# EasyEDA schematic schema_eletrico_PED.json
TITLE: Schema elettrico; REV: 1.0; Date: 2019-05-30; Sheet: 1/1; Drawn By: Berselli, Di Blasi; Company: unimore
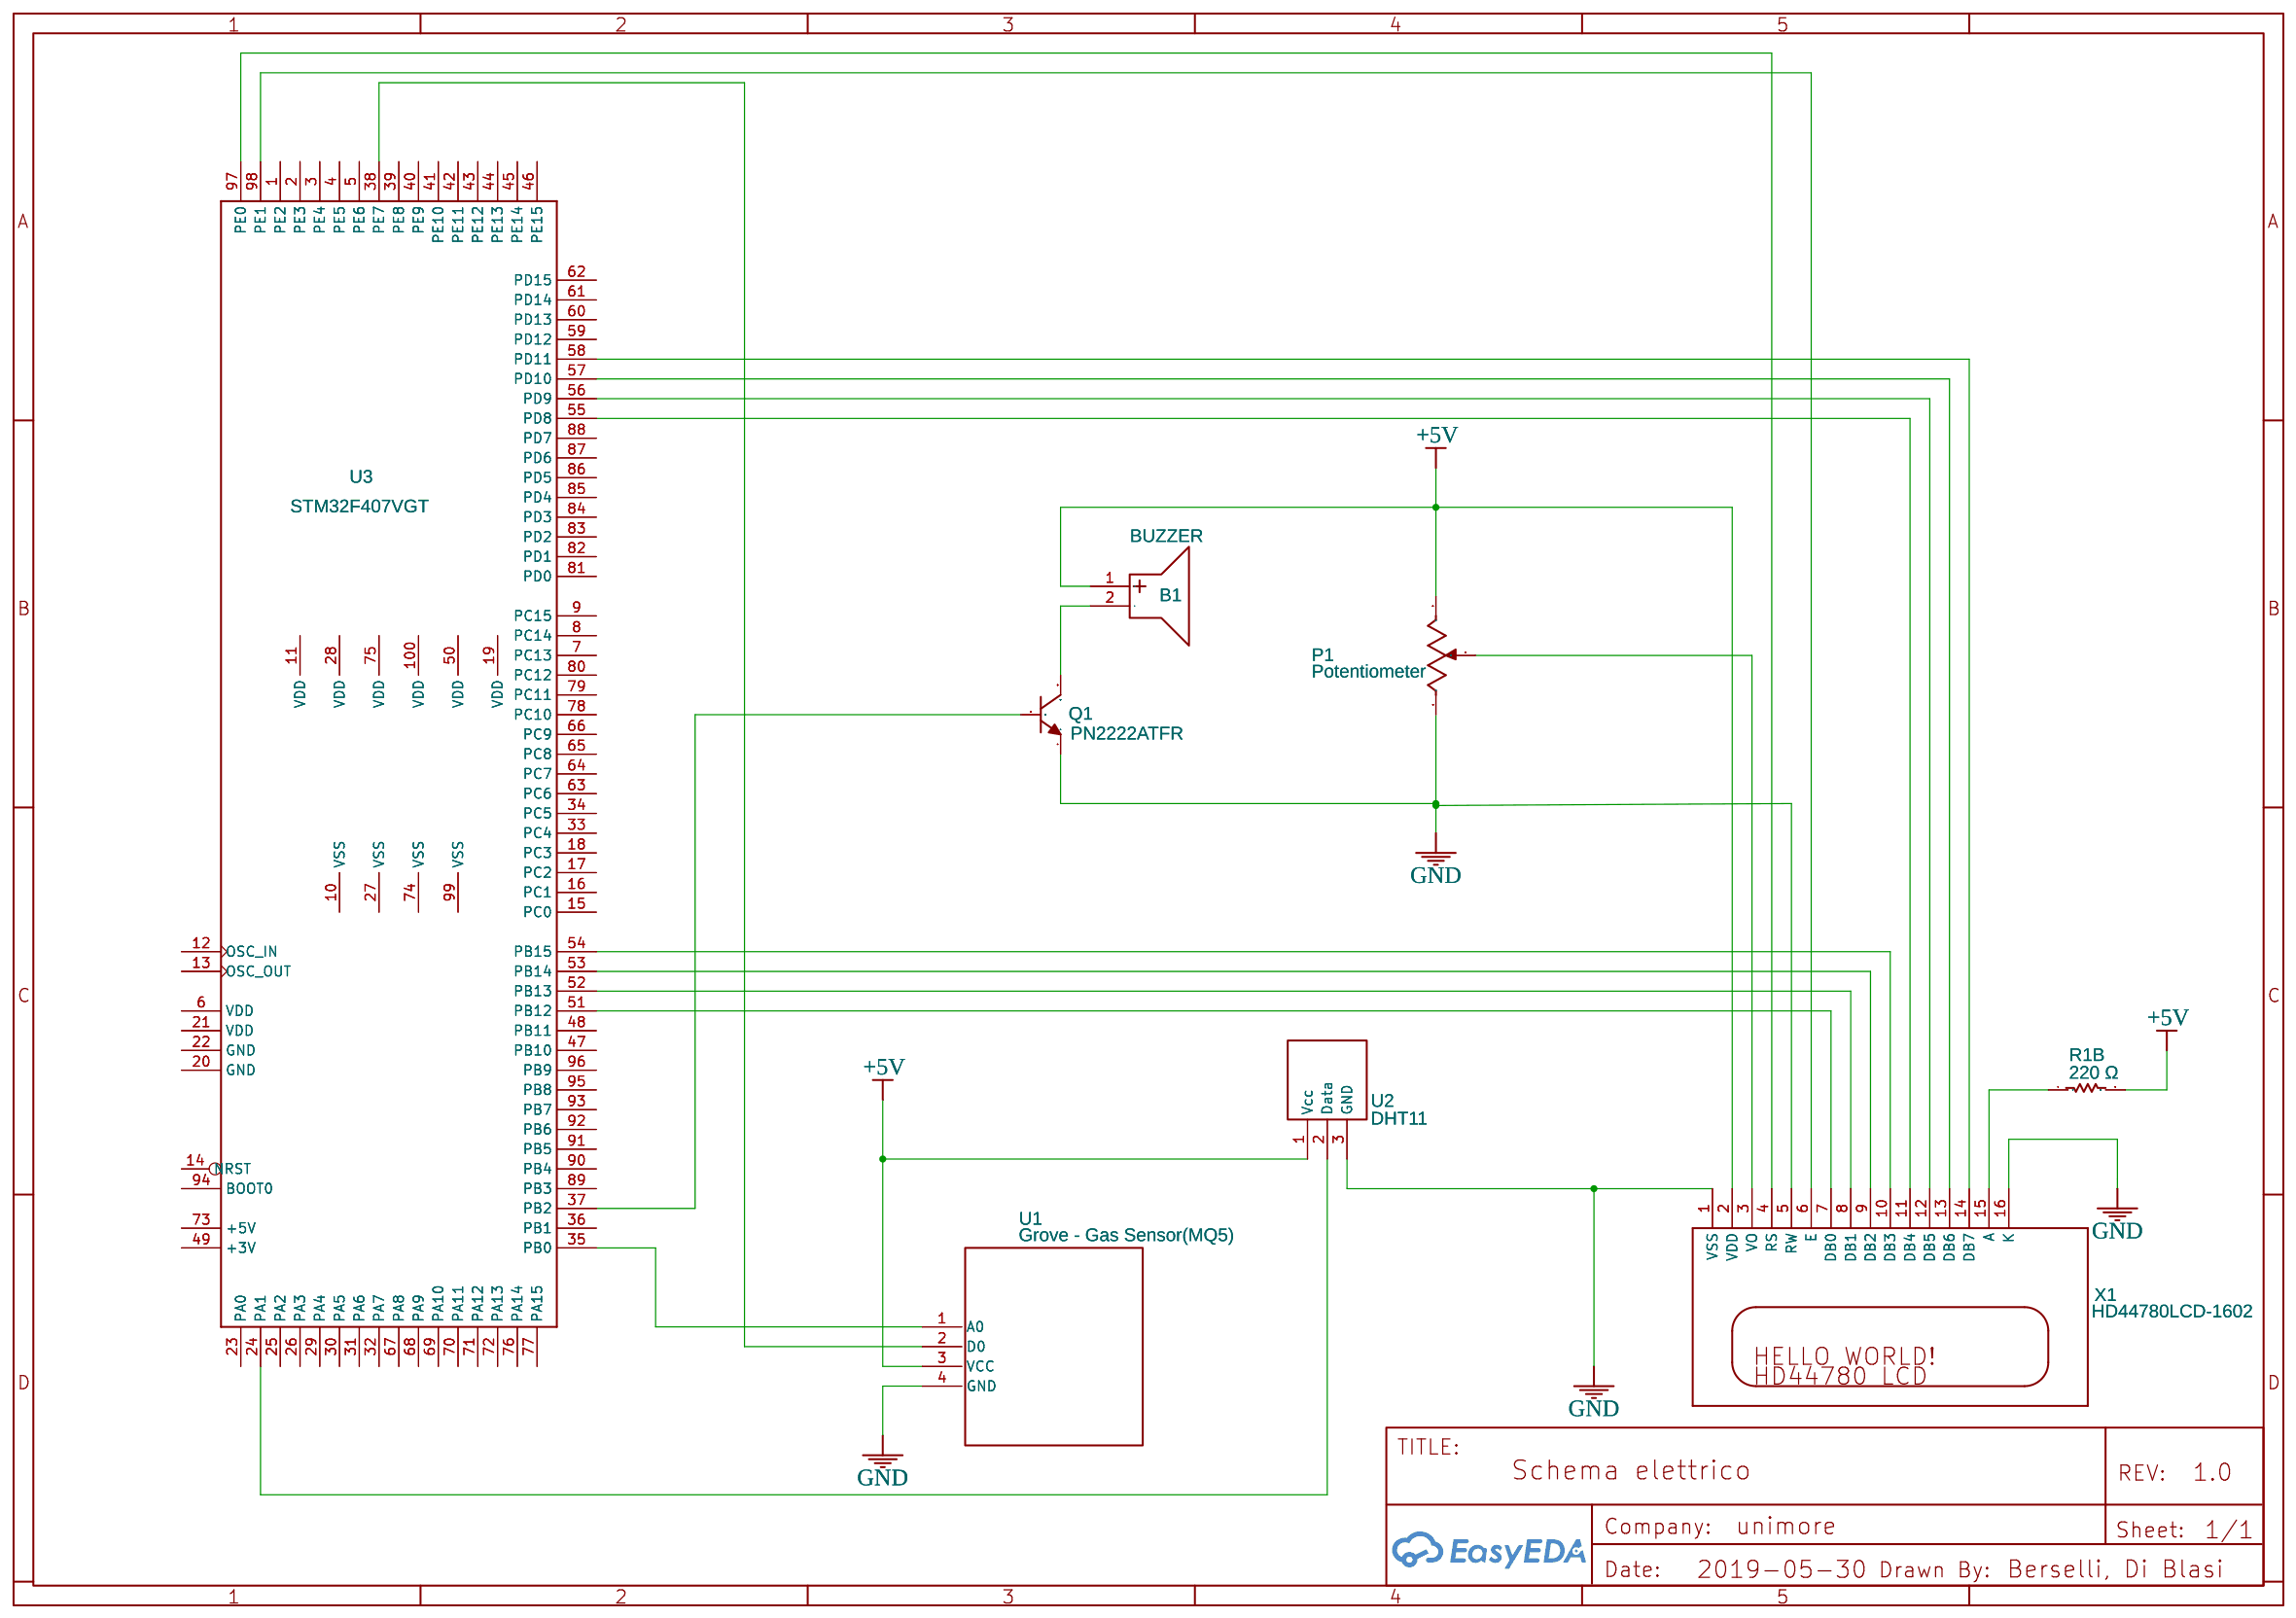
[diagram p0: schematic sheet]

## Parts
B1  BUZZER  [BUZZER-R6.0-2P-6.5PITCH]
P1  Potentiometer  [TRIM_POT]
Q1  PN2222ATFR  [TO-92(TO-92-3)-2.54]
R1B  220 Ω  [R0603]
U1  Grove - Gas Sensor(MQ5)  [GROVE - GAS SENSOR(MQ5)]
U2  DHT11
U3  STM32F407VGT  [LQFP100]
X1  HD44780LCD-1602  [LCD1602]

## Library data of the parts
B1 = -: Supplier: LCSC; Supplier Part: C187885; Manufacturer: Dongguan Bolin Elec; Manufacturer Part: BL-PBZ1209C2003YB-H; Contributor: LCSC
P1 = -: Contributor: breezebro; Manufacturer Part: ?
Q1 = -: Supplier: LCSC; Supplier Part: C184875; Manufacturer: ON Semicon; Contributor: LCSC
R1B = -: Supplier Part: P100KHCT-ND; Supplier: Digi-Key; Contributor: Mikhail Gofman; Manufacturer Part: ?
U1 = -: sourceId: yfdbxveAk; Supplier Part: undefined; Supplier: SeeedStudio; Manufacturer Part: ?
U2 = -: Contributor: Sases
U3 = -: Manufacturer Part: ?
X1 = -: HD44780 LCD; Contributor: Adafruit; Manufacturer Part: ?

## Nets
+5V: B1.1(+) P1.2(E) R1B.2 U1.3(VCC) U2.1(Vcc) X1.2(VDD)
GND: P1.3(A) Q1.1(E) U1.4(GND) U2.3(GND) X1.1(VSS) X1.5(RW) X1.16(K)
Net-(B1-2): B1.2(-) Q1.3(C)
Net-(P1-1): P1.1(S) X1.3(VO)
Net-(Q1-2): Q1.2(B) U3.37(PB2)
Net-(R1B-1): R1B.1 X1.15(A)
Net-(U1-1): U1.1(A0) U3.35(PB0)
Net-(U1-2): U1.2(D0) U3.38(PE7)
Net-(U2-2): U2.2(Data) U3.24(PA1)
Net-(U3-51): U3.51(PB12) X1.7(DB0)
Net-(U3-52): U3.52(PB13) X1.8(DB1)
Net-(U3-53): U3.53(PB14) X1.9(DB2)
Net-(U3-54): U3.54(PB15) X1.10(DB3)
Net-(U3-55): U3.55(PD8) X1.11(DB4)
Net-(U3-56): U3.56(PD9) X1.12(DB5)
Net-(U3-57): U3.57(PD10) X1.13(DB6)
Net-(U3-58): U3.58(PD11) X1.14(DB7)
Net-(U3-97): U3.97(PE0) X1.4(RS)
Net-(U3-98): U3.98(PE1) X1.6(E)

Not connected (* = marked no-connect by the designer): U3 1(PE2) 2(PE3) 3(PE4) 4(PE5) 5(PE6) 6(VDD) 7(PC13) 8(PC14) 9(PC15) 10(VSS) 11(VDD) 12(OSC_IN) 13(OSC_OUT) 14(NRST) 15(PC0) 16(PC1) 17(PC2) 18(PC3) 19(VDD) 20(GND) 21(VDD) 22(GND) 23(PA0) 25(PA2) 26(PA3) 27(VSS) 28(VDD) 29(PA4) 30(PA5) 31(PA6) 32(PA7) 33(PC4) 34(PC5) 36(PB1) 39(PE8) 40(PE9) 41(PE10) 42(PE11) 43(PE12) 44(PE13) 45(PE14) 46(PE15) 47(PB10) 48(PB11) 49(+3V) 50(VDD) 59(PD12) 60(PD13) 61(PD14) 62(PD15) 63(PC6) 64(PC7) 65(PC8) 66(PC9) 67(PA8) 68(PA9) 69(PA10) 70(PA11) 71(PA12) 72(PA13) 73(+5V) 74(VSS) 75(VDD) 76(PA14) 77(PA15) 78(PC10) 79(PC11) 80(PC12) 81(PD0) 82(PD1) 83(PD2) 84(PD3) 85(PD4) 86(PD5) 87(PD6) 88(PD7) 89(PB3) 90(PB4) 91(PB5) 92(PB6) 93(PB7) 94(BOOT0) 95(PB8) 96(PB9) 99(VSS) 100(VDD)
